# Altium schematic sheet [03] - SENSORs.SchDoc: =ProjectName
size A4; CheckedBy: DatNB; Author: Ven; CompanyName: Nacentech; Organization: IMET
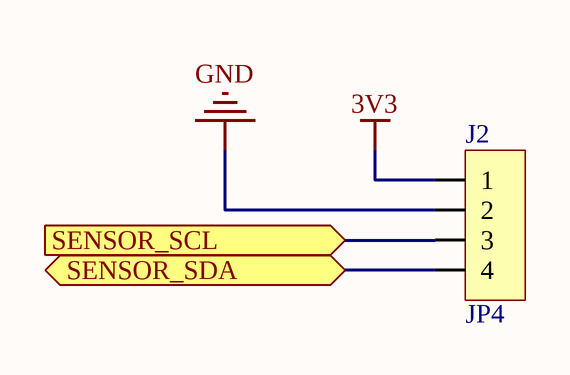
[diagram p0: [03] - SENSORs.SchDoc]

## Parts
J2  JP4  [JP4-C1T]

## Ports
SENSOR_SCL (in), SENSOR_SDA (bidir)

## Nets
3V3: J2.1
GND: J2.2
SENSOR_SCL: J2.3 ; port SENSOR_SCL
SENSOR_SDA: J2.4 ; port SENSOR_SDA

## Notes on the sheet
- Project:
- Page Contents:
- Size:
- Date:
- A4
- Checked by:
- Time:
- Revision:
- Sheet
- of
- File:

## Library data of the parts
J2 = JP4: WR-PHD 2.54 mm Angled Socket Header; Manufacturer: W¨¹rth Elektronik eiSos GmbH; partNo: 613004143121; ComponentLink1 Description: Manufacturer; ComponentLink2 Description: Datasheet; NoPins: 04; Created Date: 29 March 2013; ComponentLink1URL: http://www.we-online.com; ComponentLink2URL: http://katalog.we-online.de/em/datasheet/6130xx143121.pdf; Created by: Karrer Zheng